# EAGLE design module-simple (EAGLE 9.6.2)

## Sheet 1 of 3
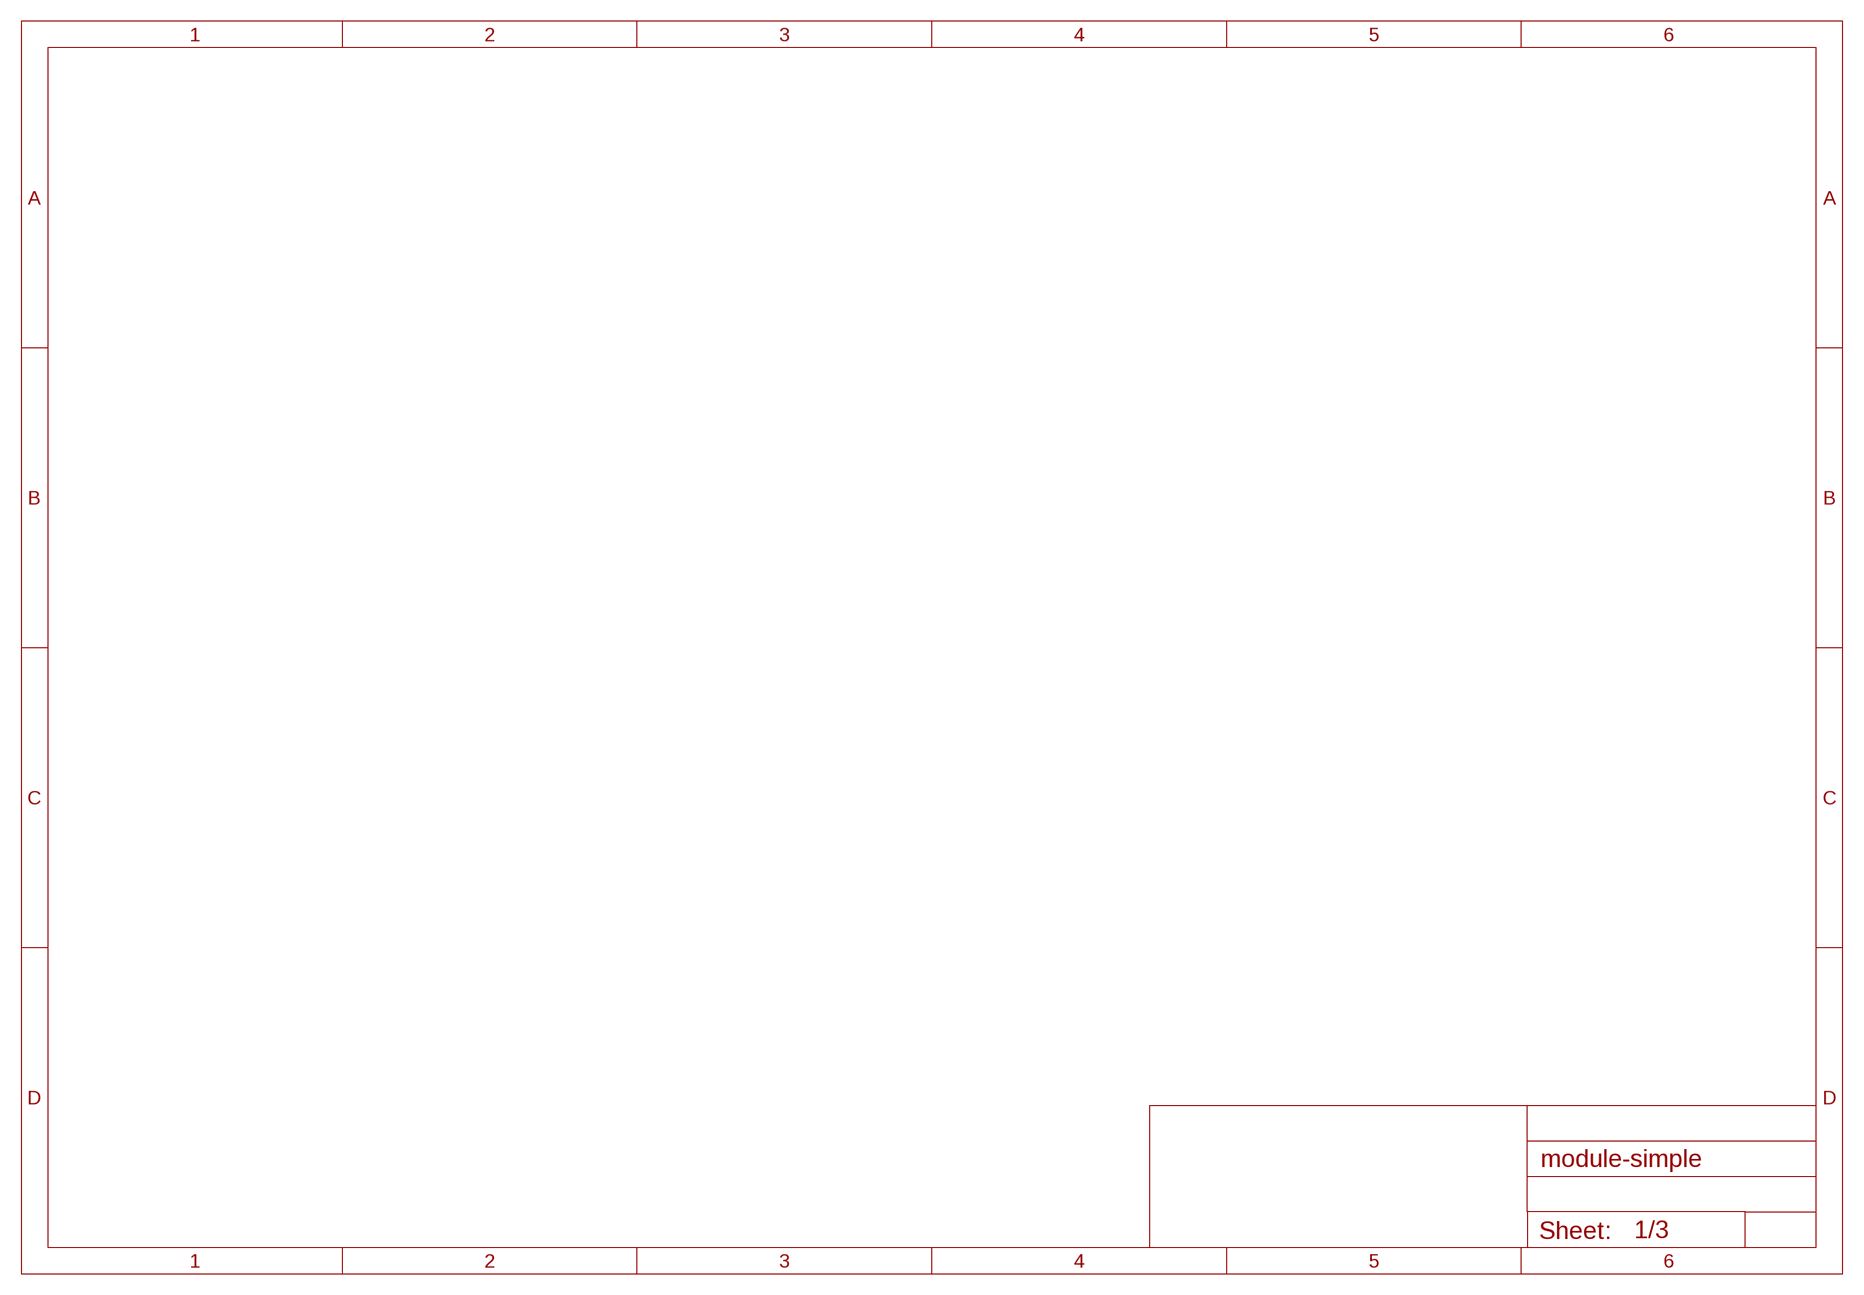
[diagram p0: schematic, sheet 1]

## Sheet 2 of 3
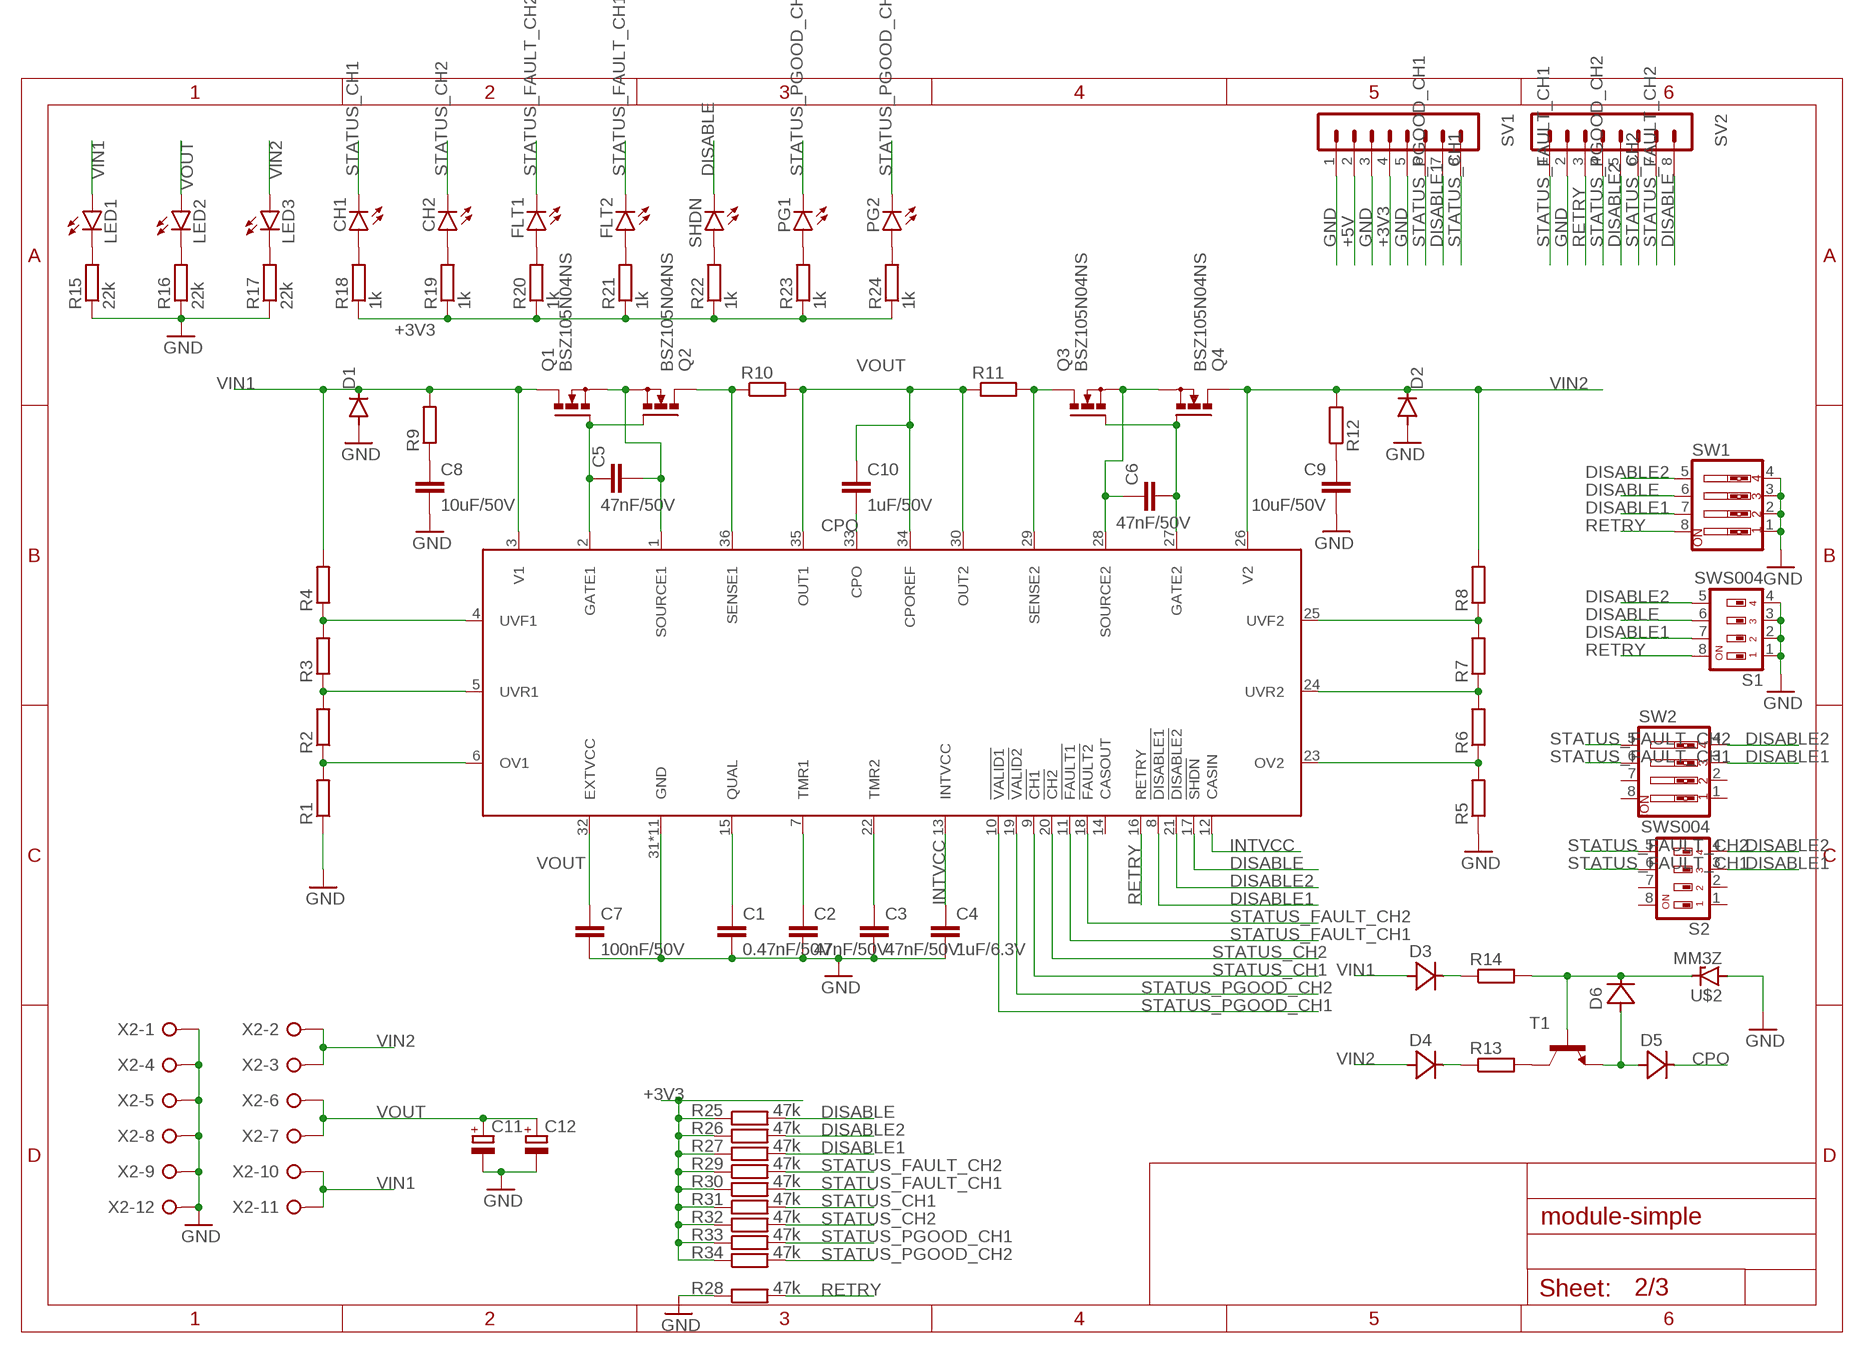
[diagram p1: schematic, sheet 2]

### Parts
C1  0.47nF/50V  C-EUC0603  [C0603]
C2  47nF/50V  C-EUC0603  [C0603]
C3  47nF/50V  C-EUC0603  [C0603]
C4  1uF/6.3V  C-EUC0603  [C0603]
C5  47nF/50V  C-EUC0603  [C0603]
C6  47nF/50V  C-EUC0603  [C0603]
C7  100nF/50V  C-EUC0603  [C0603]
C8  10uF/50V  C-EUC1206  [C1206]
C9  10uF/50V  C-EUC1206  [C1206]
C10  1uF/50V  C-EUC0805  [C0805]
C11  CPOL-EU140CLH-1010  [140CLH-1010]
C12  CPOL-EU140CLH-1010  [140CLH-1010]
CH1  LEDCHIP-LED0603  [CHIP-LED0603]
CH2  LEDCHIP-LED0603  [CHIP-LED0603]
D1  DIODE-DO214AC  [DO214AC]
D2  DIODE-DO214AC  [DO214AC]
D3  1N4148WS  [SOD323]
D4  1N4148WS  [SOD323]
D5  1N4148WS  [SOD323]
D6  1N4148WS  [SOD323]
FLT1  LEDCHIP-LED0603  [CHIP-LED0603]
FLT2  LEDCHIP-LED0603  [CHIP-LED0603]
LED1  LEDCHIP-LED0603  [CHIP-LED0603]
LED2  LEDCHIP-LED0603  [CHIP-LED0603]
LED3  LEDCHIP-LED0603  [CHIP-LED0603]
PG1  LEDCHIP-LED0603  [CHIP-LED0603]
PG2  LEDCHIP-LED0603  [CHIP-LED0603]
Q1  BSZ105N04NS  [PG-TDSON-8]
Q2  BSZ105N04NS  [PG-TDSON-8]
Q3  BSZ105N04NS  [PG-TDSON-8]
Q4  BSZ105N04NS  [PG-TDSON-8]
R1  R-EU_R0603  [R0603]
R2  R-EU_R0603  [R0603]
R3  R-EU_R0603  [R0603]
R4  R-EU_R0603  [R0603]
R5  R-EU_R0603  [R0603]
R6  R-EU_R0603  [R0603]
R7  R-EU_R0603  [R0603]
R8  R-EU_R0603  [R0603]
R9  R-EU_R0603  [R0603]
R10  R-EU_R2512  [R2512]
R11  R-EU_R2512  [R2512]
R12  R-EU_R0603  [R0603]
R13  R-EU_R0603  [R0603]
R14  R-EU_R0603  [R0603]
R15  22k  R-EU_R0603  [R0603]
R16  22k  R-EU_R0603  [R0603]
R17  22k  R-EU_R0603  [R0603]
R18  1k  R-EU_R0603  [R0603]
R19  1k  R-EU_R0603  [R0603]
R20  1k  R-EU_R0603  [R0603]
R21  1k  R-EU_R0603  [R0603]
R22  1k  R-EU_R0603  [R0603]
R23  1k  R-EU_R0603  [R0603]
R24  1k  R-EU_R0603  [R0603]
R25  47k  R-EU_R0603  [R0603]
R26  47k  R-EU_R0603  [R0603]
R27  47k  R-EU_R0603  [R0603]
R28  47k  R-EU_R0603  [R0603]
R29  47k  R-EU_R0603  [R0603]
R30  47k  R-EU_R0603  [R0603]
R31  47k  R-EU_R0603  [R0603]
R32  47k  R-EU_R0603  [R0603]
R33  47k  R-EU_R0603  [R0603]
R34  47k  R-EU_R0603  [R0603]
S1  SWS004  [SMS-004]
S2  SWS004  [SMS-004]
SHDN  LEDCHIP-LED0603  [CHIP-LED0603]
SV1  MA08-1  [MA08-1]
SV2  MA08-1  [MA08-1]
SW1  SW_DIP-4  [EDG-04]
SW2  SW_DIP-4  [EDG-04]
T1  MMBT2222ALT1-NPN-SOT23-BEC  [SOT23-BEC]
U$1  LTC4421  [QFN50P600X500X75-37T460X360N]
U$2  MM3Z  [SOD323]
X2  W237-12P  [W237-12P]

### Nets
+3V3: R18.1 R19.1 R20.1 R21.1 R22.1 R23.1 R24.1 R25.1 R26.1 R27.1 R29.1 R30.1 R31.1 R32.1 R33.1 R34.1 SV1.4 ; also sheet 3
+5V: SV1.2 ; also sheet 3
CPO: C10.2 D5.K(C) U$1.33(CPO)
DISABLE: R25.2 S1.6 SHDN.C SV2.8 SW1.6 U$1.17(!SHDN)
DISABLE1: R27.2 S1.7 S2.3 SV1.7 SW1.7 SW2.3 U$1.8(!DISABLE1)
DISABLE2: R26.2 S1.5 S2.4 SV2.5 SW1.5 SW2.4 U$1.21(!DISABLE2)
GND: C1.2 C2.2 C3.2 C4.2 C7.2 C8.2 C9.2 C11.- C12.- D1.A D2.A R1.1 R5.1 R15.1 R16.1 R17.1 R28.1 S1.1 S1.2 S1.3 S1.4 SV1.1 SV1.3 SV1.5 SV2.2 SW1.1 SW1.2 SW1.3 SW1.4 U$1.31(GND) U$1.37(GND) U$1.P$1(GND) U$1.P$2(GND) U$1.P$3(GND) U$1.P$4(GND) U$1.P$5(GND) U$1.P$6(GND) U$1.P$7(GND) U$1.P$8(GND) U$1.P$9(GND) U$2.A X2.1 X2.4 X2.5 X2.8 X2.9 X2.12 ; also sheet 3
INTVCC: C4.1 U$1.12(CASIN) U$1.13(INTVCC)
N$1: R1.2 R2.1 U$1.6(OV1)
N$2: R2.2 R3.1 U$1.5(UVR1)
N$3: R3.2 R4.1 U$1.4(UVF1)
N$4: R5.2 R6.1 U$1.23(OV2)
N$5: R6.2 R7.1 U$1.24(UVR2)
N$6: R7.2 R8.1 U$1.25(UVF2)
N$7: C5.1 Q1.4(G) Q2.4(G) U$1.2(GATE1)
N$8: C5.2 Q1.1(S) Q1.2(S) Q1.3(S) Q2.1(S) Q2.2(S) Q2.3(S) U$1.1(SOURCE1)
N$9: Q2.5(D) Q2.6(D) Q2.7(D) Q2.8(D) Q2.TH(D) R10.1 U$1.36(SENSE1)
N$10: C8.1 R9.1
N$11: C9.1 R12.1
N$12: D4.K(C) R13.1
N$13: C1.1 U$1.15(QUAL)
N$14: Q3.5(D) Q3.6(D) Q3.7(D) Q3.8(D) Q3.TH(D) R11.2 U$1.29(SENSE2)
N$15: C6.2 Q3.4(G) Q4.4(G) U$1.27(GATE2)
N$16: C6.1 Q3.1(S) Q3.2(S) Q3.3(S) Q4.1(S) Q4.2(S) Q4.3(S) U$1.28(SOURCE2)
N$17: D3.K(C) R14.1
N$18: C2.1 U$1.7(TMR1)
N$19: C3.1 U$1.22(TMR2)
N$21: R13.2 T1.C
N$22: D6.K(C) R14.2 T1.B U$2.K
N$23: D5.A D6.A T1.E
N$24: LED1.C R15.2
N$25: LED2.C R16.2
N$26: LED3.C R17.2
N$27: CH1.A R18.2
N$28: CH2.A R19.2
N$29: FLT1.A R20.2
N$30: FLT2.A R21.2
N$31: R22.2 SHDN.A
N$32: PG1.A R23.2
N$34: PG2.A R24.2
RETRY: R28.2 S1.8 SV2.3 SW1.8 U$1.16(RETRY)
STATUS_CH1: CH1.C R31.2 SV1.8 U$1.9(!CH1)
STATUS_CH2: CH2.C R32.2 SV2.6 U$1.20(!CH2)
STATUS_FAULT_CH1: FLT2.C R30.2 S2.6 SV2.1 SW2.6 U$1.11(!FAULT1)
STATUS_FAULT_CH2: FLT1.C R29.2 S2.5 SV2.7 SW2.5 U$1.18(!FAULT2)
STATUS_PGOOD_CH1: PG1.C R33.2 SV1.6 U$1.10(!VALID1)
STATUS_PGOOD_CH2: PG2.C R34.2 SV2.4 U$1.19(!VALID2)
VIN1: D1.C D3.A LED1.A Q1.5(D) Q1.6(D) Q1.7(D) Q1.8(D) Q1.TH(D) R4.2 R9.2 U$1.3(V1) X2.10 X2.11
VIN2: D2.C D4.A LED3.A Q4.5(D) Q4.6(D) Q4.7(D) Q4.8(D) Q4.TH(D) R8.2 R12.2 U$1.26(V2) X2.2 X2.3
VOUT: C7.1 C10.1 C11.+ C12.+ LED2.A R10.2 R11.1 U$1.30(OUT2) U$1.32(EXTVCC) U$1.34(CPOREF) U$1.35(OUT1) X2.6 X2.7 ; also sheet 3
Unconnected: S2.1 S2.2 S2.7 S2.8 SW2.1 SW2.2 SW2.7 SW2.8 U$1.14(CASOUT)

## Sheet 3 of 3
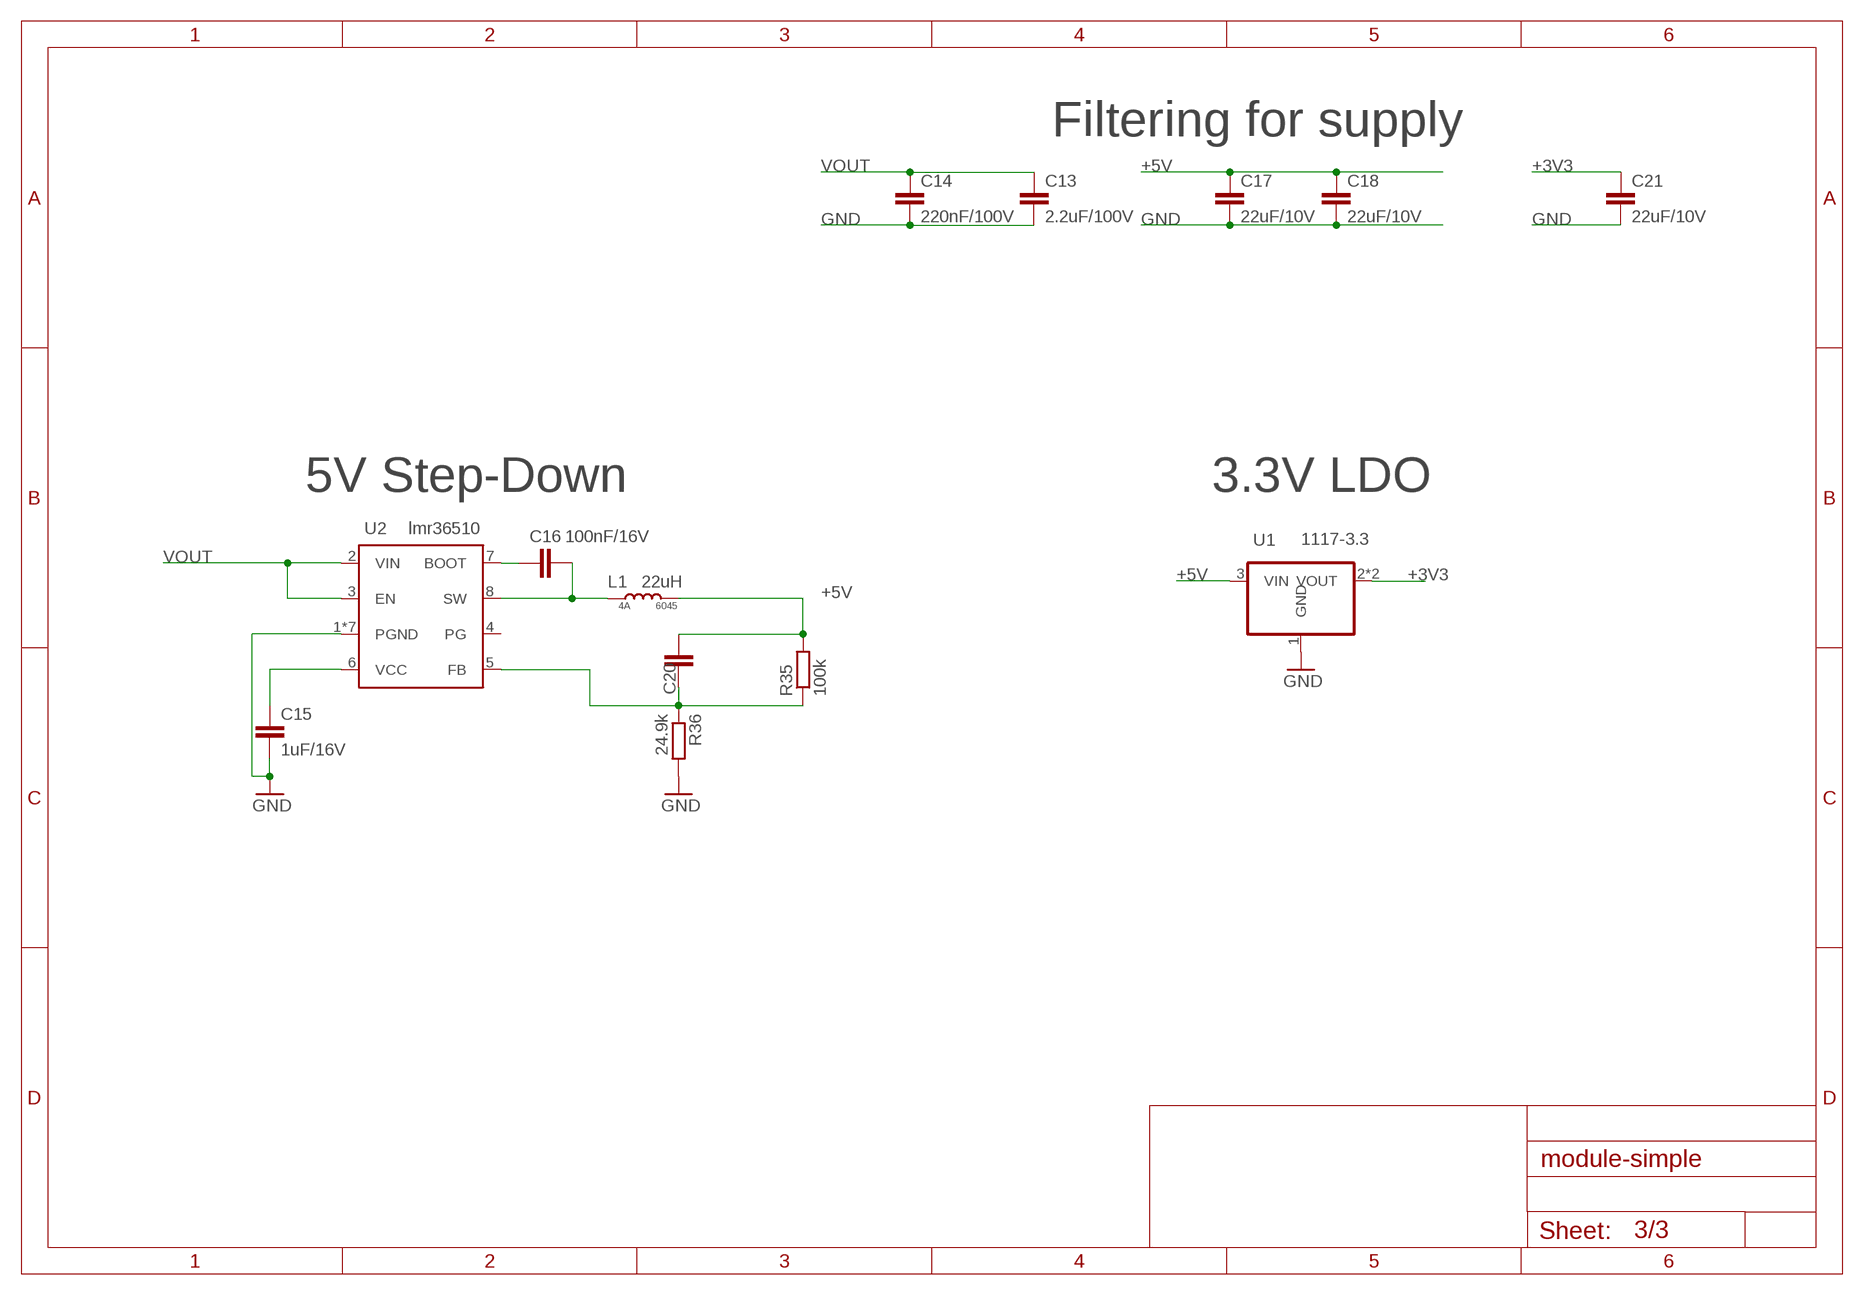
[diagram p2: schematic, sheet 3]

### Parts
C13  2.2uF/100V  C-EUC1210  [C1210]
C14  220nF/100V  C-EUC1210  [C1210]
C15  1uF/16V  C-EUC0805  [C0805]
C16  100nF/16V  C-EUC0805  [C0805]
C17  22uF/10V  C-EUC1210  [C1210]
C18  22uF/10V  C-EUC1210  [C1210]
C20  C-EUC0603  [C0603]
C21  22uF/10V  C-EUC1210  [C1210]
L1  22uH  DJNR6045  [DJNR6045]
R35  100k  R-EU_R0603  [R0603]
R36  24.9k  R-EU_R0603  [R0603]
U1  1117-3.3  LD1117S50  [SOT230P700X180-4]
U2  lmr36510  LMR36510  [SOIC127P600X170-9T240X310N]

### Nets
+3V3: C21.1 U1.2(VOUT) U1.4(VOUT) ; also sheet 2
+5V: C17.1 C18.1 C20.2 L1.P$2 R35.2 U1.3(VIN) ; also sheet 2
GND: C13.2 C14.2 C15.2 C17.2 C18.2 C21.2 R36.2 U1.1(GND) U2.1(PGND) U2.9(PGND) U2.P$1(PGND) U2.P$2(PGND) U2.P$3(PGND) U2.P$4(PGND) U2.P$5(PGND) ; also sheet 2
N$20: C15.1 U2.6(VCC)
N$33: C16.1 U2.7(BOOT)
N$35: C16.2 L1.P$1 U2.8(SW)
N$36: C20.1 R35.1 R36.1 U2.5(FB)
VOUT: C13.1 C14.1 U2.2(VIN) U2.3(EN) ; also sheet 2
Unconnected: U2.4(PG)

### Notes on the sheet
- Filtering for supply
- 5V Step-Down | 3.3V LDO

## Library data of the parts
C1-C10 C13-C18 C20 C21 = rcl:C-EU: CAPACITOR, European symbol; SPICEPREFIX: C
C11 C12 = rcl:CPOL-EU: POLARIZED CAPACITOR, European symbol; SPICEPREFIX: C
CH1 CH2 FLT1 FLT2 LED1-LED3 PG1 PG2 SHDN = led:LED: LED OSRAM: - CHIPLED LG R971, LG N971, LY N971, LG Q971, LY Q971, LO R971, LY R971 LH N974, LH R974 LS Q976, LO Q976, LY Q976 LO Q996 - Hyper CHIPLED LW Q18S LB Q993, LB Q99A, LB R99A - SideLED LS A670, LO A670, LY A670, LG A670, LP A670 LB A673, LV A673, LT A673, LW A673 LH A674 LY A675 LS A676, LA A676, LO A676, LY A676, LW A676 LS A679, LY A679, LG A679 - Hyper Micro SIDELED® LS Y876, LA Y876, LO Y876, LY Y876 LT Y87S - SmartLED LW L88C, LW L88S LB L89C, LB L89S, LG L890 LS L89K, LO L89K, LY L89K LS L896, LA L896, LO L896, LY L896 - TOPLED LS T670, LO T670, LY T670, LG T670, LP T670 LSG T670, LSP T670, LSY T670, LOP T670, LYG T670 LG T671, LOG T671, LSG T671 LB T673, LV T673, LT T673, LW T673 LH T674 LS T676, LA T676, LO T676, LY T676, LB T676, LH T676, LSB T676, LW T676 LB T67C, LV T67C, LT T67C, LS T67K, LO T67K, LY T67K, LW E67C LS E67B, LA E67B, LO E67B, LY E67B, LB E67C, LV E67C, LT E67C LW T67C LS T679, LY T679, LG T679 LS T770, LO T770, LY T770, LG T770, LP T770 LB T773, LV T773, LT T773, LW T773 LH T774 LS E675, LA E675, LY E675, LS T675 LS T776, LA T776, LO T776, LY T776, LB T776 LHGB T686 LT T68C, LB T68C - Hyper Mini TOPLED® LB M676 - Mini TOPLED Santana® LG M470 LS M47K, LO M47K, LY M47K Source: http://www.osram.convergy.de LUXEON: - LUMILED® LXK2-PW12-R00, LXK2-PW12-S00, LXK2-PW14-U00, LXK2-PW14-V00 LXK2-PM12-R00, LXK2-PM12-S00, LXK2-PM14-U00 LXK2-PE12-Q00, LXK2-PE12-R00, LXK2-PE12-S00, LXK2-PE14-T00, LXK2-PE14-U00 LXK2-PB12-K00, LXK2-PB12-L00, LXK2-PB12-M00, LXK2-PB14-N00, LXK2-PB14-P00, LXK2-PB14-Q00 LXK2-PR12-L00, LXK2-PR12-M00, LXK2-PR14-Q00, LXK2-PR14-R00 LXK2-PD12-Q00, LXK2-PD12-R00, LXK2-PD12-S00 LXK2-PH12-R00, LXK2-PH12-S00 LXK2-PL12-P00, LXK2-PL12-Q00, LXK2-PL12-R00 Source: www.luxeon.com KINGBRIGHT: KA-3528ASYC Source: www.kingbright.com
D1 D2 = diode:DIODE-: DIODE
D3-D6 = parts-diotec:1N4148WS
L1 = parts-ferrocore:DJNR6045; CURRENT: 4A; PACKAGE: 6045
Q1-Q4 = transistor-power:BSZ105N04NS: OptiMOS (TM)3 Power-Transistor N-Channel, Normal level Source : Data sheet <http://www.infineon.com/dgdl/BSZ105N04NSG_rev1.1.pdf?folderId=db3a3043156fd5730115c7d50620107c&fileId=db3a30431689f4420116c485c67f084e>
R1-R36 = rcl:R-EU_: RESISTOR, European symbol; SPICEPREFIX: R
S1 S2 = smd-special:SWS004: SMD Dip Switch 4 pol.
SV1 SV2 = con-lstb:MA08-1: PIN HEADER; OC_FARNELL: unknown; OC_NEWARK: unknown
SW1 SW2 = special:SW_DIP-4: DIP SWITCH
T1 = transistor-neu-to92:*-NPN-: NPN Transistror
U1 = parts-st:LD1117
U2 = parts-ti:LMR36510
U$1 = parts-analog_dev:LTC4421
U$2 = parts-onsemi:MM3Z
X2 = con-wago-508:W237-12P: WAGO SREW CLAMP; OC_FARNELL: unknown; OC_NEWARK: unknown

## Board
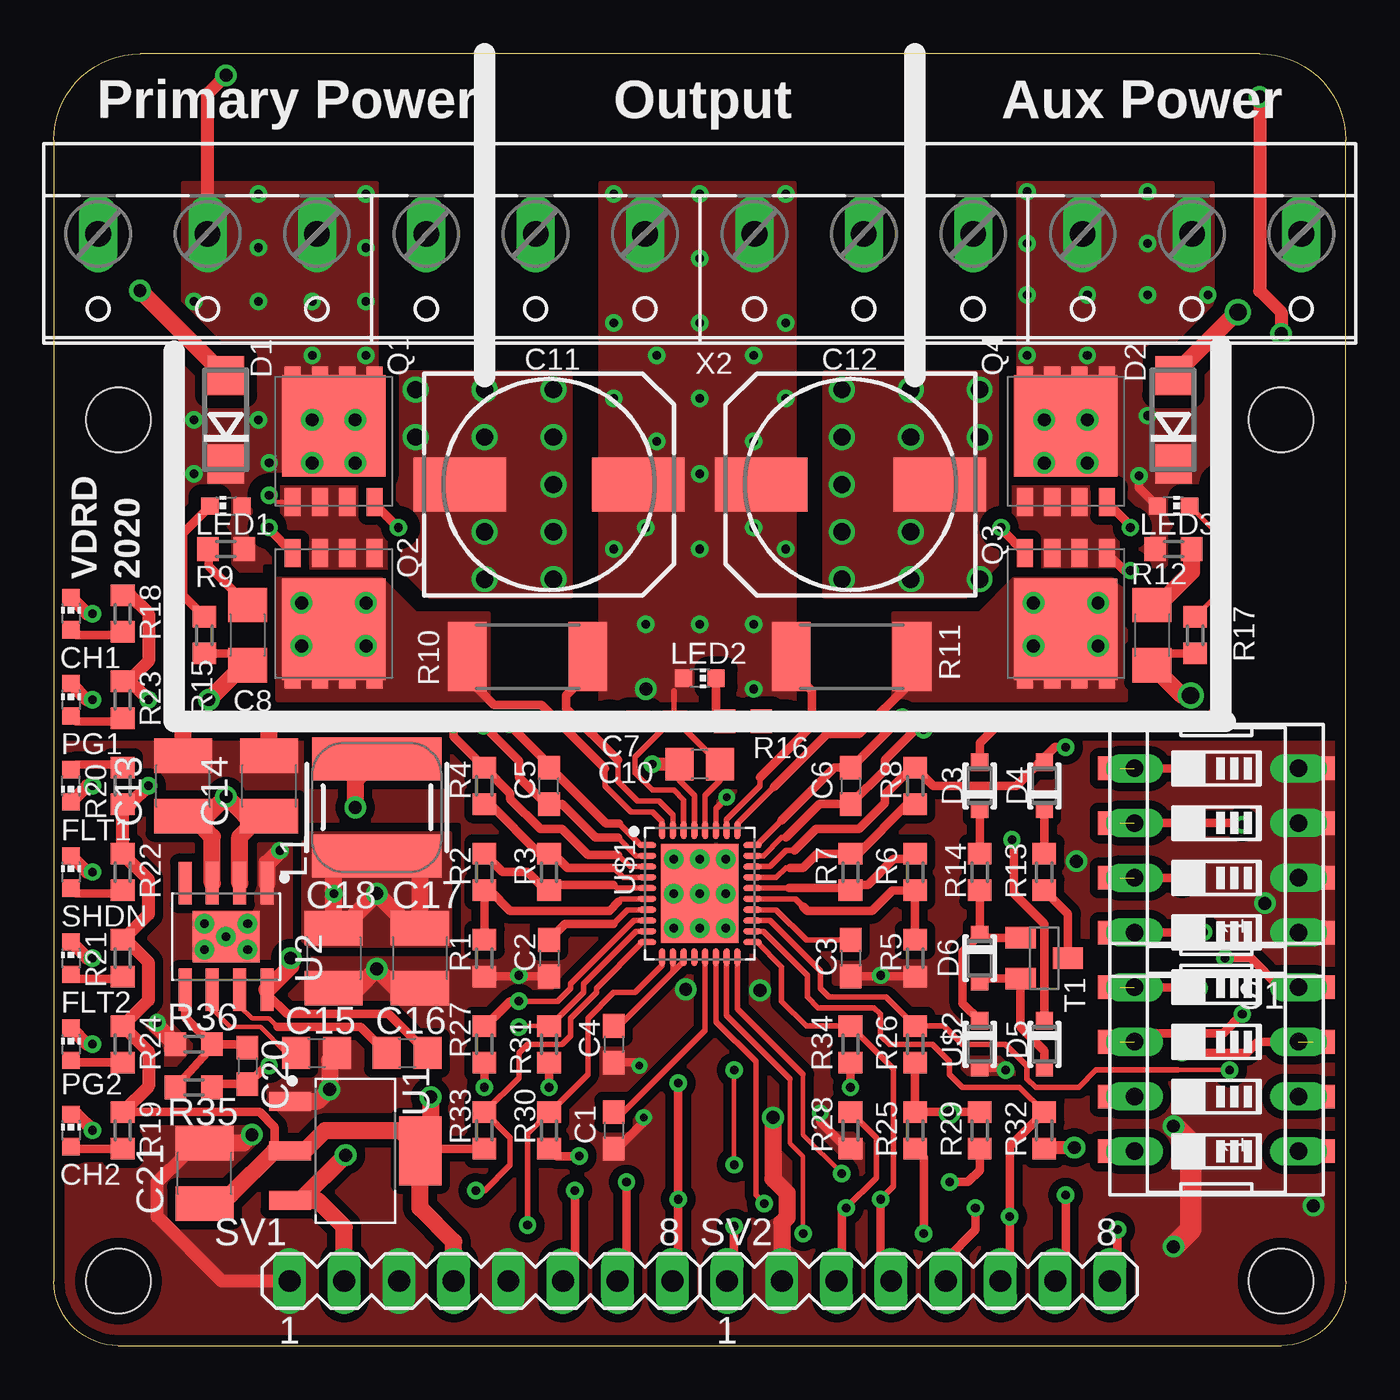
[diagram p3: board, top side]
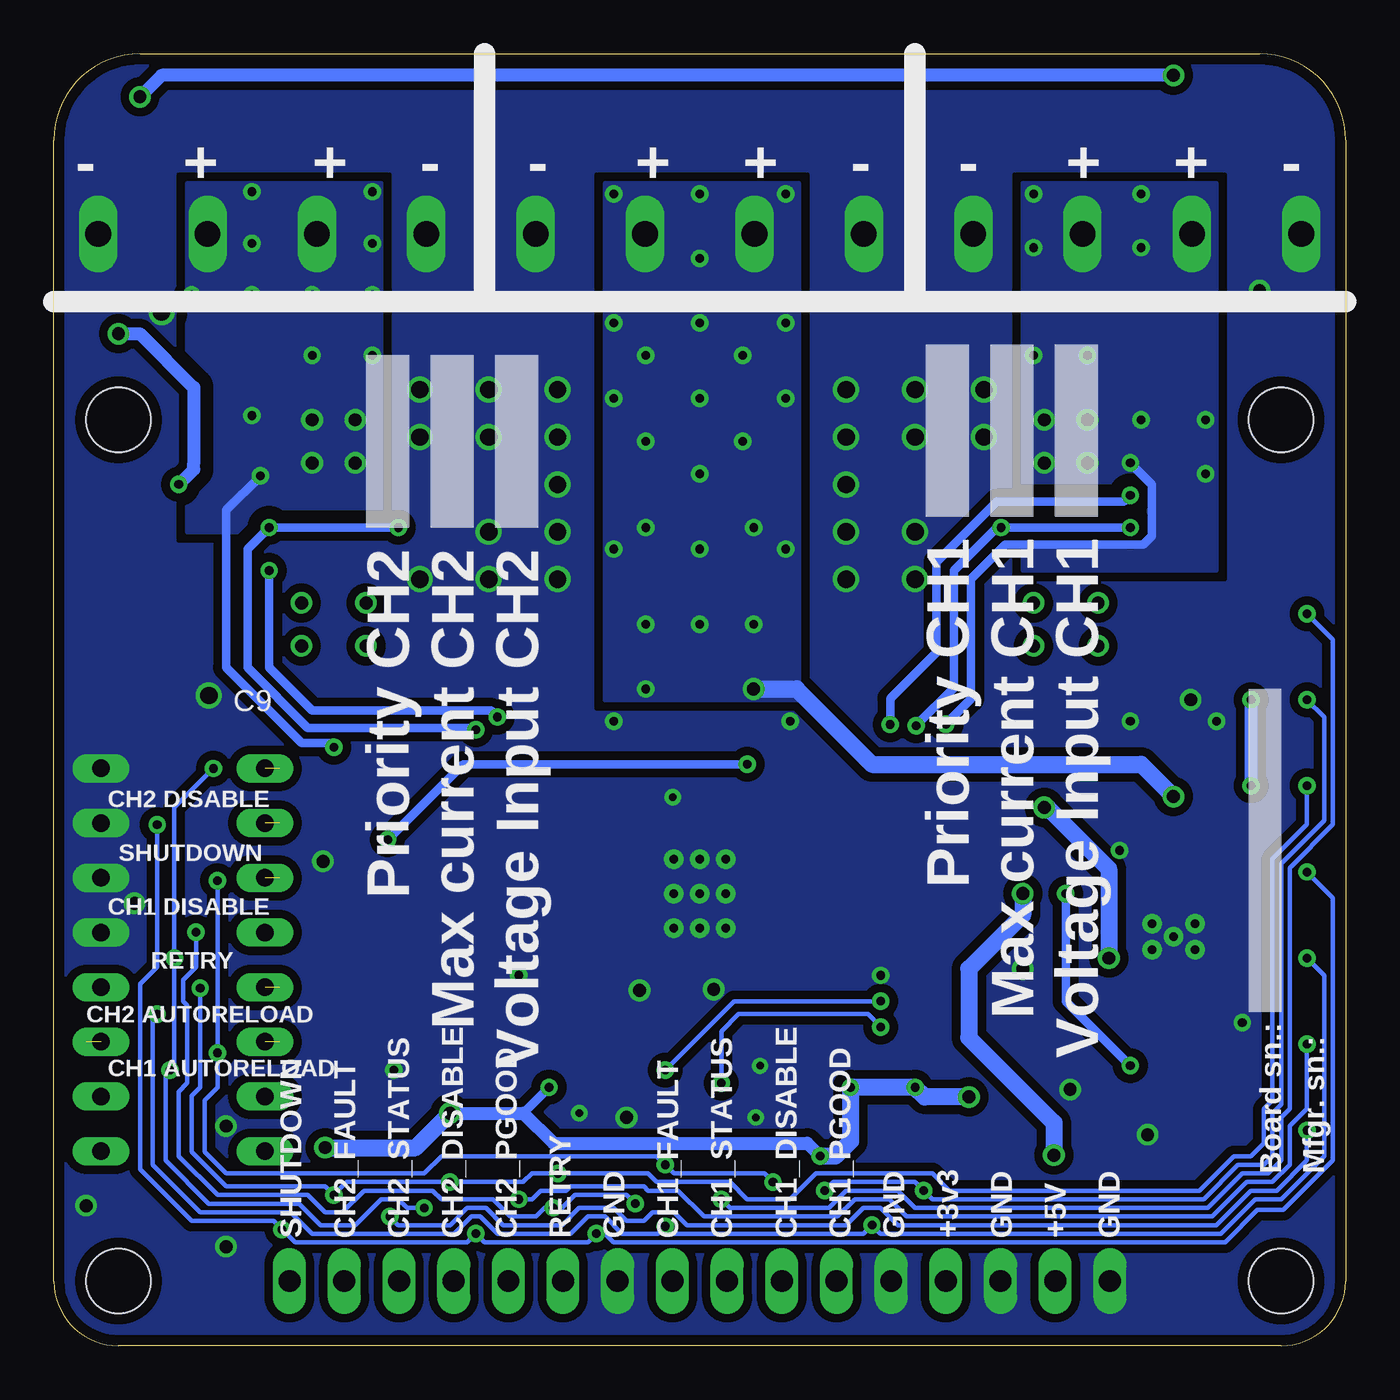
[diagram p4: board, bottom side, seen from below]

Size 60 x 60 mm. Coordinates in mm from the lower left corner, seen from the top.
Outline: 3,0 57,0 arc90 60,3 60,56 arc90 56,60 4,60 arc90 0,56 0,3 arc90 3,0
Copper layers (1*16): Top 0.035mm / dielectric 1.5mm / Bottom 0.035mm
Design rules "default *": minimum track width 6mil, minimum drill 0.2mm, track to track 6mil, track to pad 6mil, pad to pad 6mil, via to via 6mil, smd to smd 6mil, copper to edge 0.5mm, drill to drill 6mil, minimum pad ring 10mil, minimum via ring 8mil, stop-mask expansion 4mil, vias tented up to drill 0.6mm, thermal gap 10mil
Holes 3 mm at 3,43 57,43 3,3 57,3
tKeepout: area 54,40 to 60,46; area 54,0 to 60,6; area 0,0 to 6,6; area 0,40 to 6,46

### Footprints (pad centres in the part's own frame; a part is rotated, then mirrored left to right if it is on the bottom)
C0603 = smd 1.1 x 1: 1 -0.85,0; 2 0.85,0
C1206 = smd 1.6 x 1.8: 1 -1.4,0; 2 1.4,0
C0805 = smd 1.3 x 1.5: 1 -0.95,0; 2 0.95,0
140CLH-1010 = smd 4.3 x 2.5: + 4.15,0; - -4.15,0
C1210 = smd 1.6 x 2.7: 1 -1.4,0; 2 1.4,0
CHIP-LED0603 = smd 0.8 x 0.8: A 0,-0.75; C 0,0.75
DO214AC = smd 1.8 x 1.7: A 2.05,0; C -2.05,0
SOD323 = smd 0.8 x 0.8: A 1.1,0; K -1.1,0
DJNR6045 = smd 2 x 6: P$1 -2.25,0; P$2 2.25,0
PG-TDSON-8 = smd 1.3 x 0.75: 1 -2.825,1.905; 2 -2.825,0.635; 3 -2.825,-0.635; 4 -2.825,-1.905; 5 2.825,-1.905; 6 2.825,-0.635; 7 2.825,0.635; 8 2.825,1.905 | smd 4.7 x 4.8: TH 0.725,0
R0603 = smd 1 x 1.1: 1 -0.85,0; 2 0.85,0
R2512 = smd 1.8 x 3.2: 1 -2.8,0; 2 2.8,0
SMS-004 = smd 1.092 x 2.007: 1 -3.81,-4.496; 2 -1.27,-4.496; 3 1.27,-4.496; 4 3.81,-4.496; 5 3.81,4.496; 6 1.27,4.496; 7 -1.27,4.496; 8 -3.81,4.496
MA08-1 = drill 1.016 long: 1 -8.89,0; 2 -6.35,0; 3 -3.81,0; 4 -1.27,0; 5 1.27,0; 6 3.81,0; 7 6.35,0; 8 8.89,0
EDG-04 = drill 0.813 long: 1 -3.81,-3.81; 2 -1.27,-3.81; 3 1.27,-3.81; 4 3.81,-3.81; 5 3.81,3.81; 6 1.27,3.81; 7 -1.27,3.81; 8 -3.81,3.81
SOT23-BEC = smd 1 x 1.4: B -0.95,-1.1; C 0,1.1; E 0.95,-1.1
SOT230P700X180-4 = smd 1.965 x 0.889: 1 -3.023,2.3; 2 -3.023,0; 3 -3.023,-2.3 | smd 1.965 x 3.189: 4 3.023,0
SOIC127P600X170-9T240X310N = smd 1.968 x 0.602: 1 -2.473,1.905; 2 -2.473,0.635; 3 -2.473,-0.635; 4 -2.473,-1.905; 5 2.473,-1.905; 6 2.473,-0.635; 7 2.473,0.635; 8 2.473,1.905 | smd 2.4 x 3.1: 9 0,0 | drill 0.4: P$1 -0.6,1; P$2 0.6,1; P$3 -0.6,-1; P$4 0.6,-1; P$5 0,0
QFN50P600X500X75-37T460X360N = smd 0.83 x 0.27: 1 -2.45,2.25; 2 -2.45,1.75; 3 -2.45,1.25; 4 -2.45,0.75; 5 -2.45,0.25; 6 -2.45,-0.25; 7 -2.45,-0.75; 8 -2.45,-1.25; 9 -2.45,-1.75; 10 -2.45,-2.25; 19 2.45,-2.25; 20 2.45,-1.75; 21 2.45,-1.25; 22 2.45,-0.75; 23 2.45,-0.25; 24 2.45,0.25; 25 2.45,0.75; 26 2.45,1.25; 27 2.45,1.75; 28 2.45,2.25 | smd 0.27 x 0.83: 11 -1.75,-2.95; 12 -1.25,-2.95; 13 -0.75,-2.95; 14 -0.25,-2.95; 15 0.25,-2.95; 16 0.75,-2.95; 17 1.25,-2.95; 18 1.75,-2.95; 29 1.75,2.95; 30 1.25,2.95; 31 0.75,2.95; 32 0.25,2.95; 33 -0.25,2.95; 34 -0.75,2.95; 35 -1.25,2.95; 36 -1.75,2.95 | smd 3.6 x 4.6: 37 0,0 | drill 0.4: P$1 -1.2,1.6; P$2 0,1.6; P$3 1.2,1.6; P$4 1.2,0; P$5 0,0; P$6 -1.2,0; P$7 -1.2,-1.6; P$8 0,-1.6; P$9 1.2,-1.6
W237-12P = drill 1.194 long: 1 -27.94,-0.635; 2 -22.86,-0.635; 3 -17.78,-0.635; 4 -12.7,-0.635; 5 -7.62,-0.635; 6 -2.54,-0.635; 7 2.54,-0.635; 8 7.62,-0.635; 9 12.7,-0.635; 10 17.78,-0.635; 11 22.86,-0.635; 12 27.94,-0.635

### Placement (x,y rotation side)
C1  26,10 270 top
C2  23,18 270 top
C3  37,18 270 top
C4  26,14 270 top
C5  23,26 90 top
C6  37,26 270 top
C7  28,29 180 top
C8  9,33 270 top
C9  51,33 270 top
C10  30,27 180 top
C11  23,40 0 top
C12  37,40 180 top
C13  6,26 90 top
C14  10,26 90 top
C15  12.2,13.6 0 top
C16  16.4,13.6 0 top
C17  17,18 270 top
C18  13,18 270 top
C20  9,13 270 top
C21  7,8 90 top
CH1  0.8,34 0 top
CH2  0.8,10 0 top
D1  8,43 90 top
D2  52,43 90 top
D3  43,26 90 top
D4  46,26 90 top
D5  46,14 270 top
D6  43,18 270 top
FLT1  0.8,26 180 top
FLT2  0.8,18 0 top
L1  15,25 270 top
LED1  8,39 90 top
LED2  30,31 270 top
LED3  52,39 270 top
PG1  0.8,30 0 top
PG2  0.8,14 0 top
Q1  13,42 90 top
Q2  13,34 270 top
Q3  47,34 270 top
Q4  47,42 90 top
R1  20,18 90 top
R2  20,22 90 top
R3  23,22 90 top
R4  20,26 90 top
R5  40,18 90 top
R6  40,22 90 top
R7  37,22 90 top
R8  40,26 90 top
R9  8,37 0 top
R10  22,32 0 top
R11  37.05,32 0 top
R12  52,37 180 top
R13  46,22 270 top
R14  43,22 270 top
R15  7,33 90 top
R16  32,29 180 top
R17  53,33 90 top
R18  3.2,34 270 top
R19  3.2,10 270 top
R20  3.2,26 90 top
R21  3.2,18 270 top
R22  3.2,22 270 top
R23  3.2,30 270 top
R24  3.2,14 270 top
R25  40,10 270 top
R26  40,14 90 top
R27  20,14 90 top
R28  37,10 90 top
R29  43,10 270 top
R30  23,10 90 top
R31  23,14 90 top
R32  46,10 90 top
R33  20,10 90 top
R34  37,14 90 top
R35  6.5,12 0 top
R36  6.5,14 180 top
S1  54,23 90 top
S2  54,12.84 90 top
SHDN  0.8,22 0 top
SV1  19.84,3 0 top
SV2  40.16,3 0 top
SW1  54,23 90 top
SW2  54,12.84 90 top
T1  46,18 270 top
U1  14,9.05 0 top
U2  8,19 270 top
U$1  30,21 0 top
U$2  43,14 270 top
X2  30,51 180 top

### Tracks (layer width: path | path; a pad name or v marks a point on that pad's centre or on a via)
+3V3  (via drill 0.4, 0.6)
  Top 0.4: R19.1 9.55,10.85 10.25,10.15 10.25,9.05 | R26.1 R25.1 41.55,10.85 v41.6,10.8 41.65,10.85 R29.1 | R27.1 v20,12 | v24.4,8.8 23.35,8.8 R30.1 | R31.1 v23,12 | R34.1 v37,12 | R33.1 17.12,9.15 17,9.03
  Top 0.6: 3.55,10.85 R19.1 4.4,12.05 4.4,13.65 R24.1 4.4,16.05 4.4,17.8 3.35,18.85 R21.1 4.4,20.05 4.4,21.65 R22.1 R20.1 3.55,25.15 v4.4,26 | R18.1 3.55,34.85 4.4,34 4.4,31.8 3.45,30.85 R23.1 3.55,30.85 v4.4,30 | 19.9,9.05 R33.1 | v47.4,9.2 46.05,9.2 R32.1
  Top 0.8: U1.4 16.07,10 12.6,10 11.65,9.05 U1.2 10.25,9.05 8.2,7 7.4,7 C21.1 6.2,6.6 | SV1.4 18.57,4.83 17,6.4 17,9.03 U1.4 | U1.4 17.5,9.53 v17.5,11.55
  Bottom 0.4: v37,12 38.2,10.8
  Bottom 0.6: v4.4,30 v4.4,26 | v24.4,8.8 25,9.4 36.8,9.4 38.2,10.8 v41.6,10.8
  Bottom 0.8: v47.4,9.2 43.2,9.2 v41.6,10.8 | v17.5,11.55 19.55,11.55 v20,12 v23,12 23,9.5 23.7,8.8 v24.4,8.8
+5V  (via drill 0.4, 0.6)
  Top 0.4: v10,13 9.85,13 C20.2 7.5,12.15 R35.2
  Top 0.8: 13,22.5 v13,21 C18.1 13.4,19.4 v15,21 16.6,19.4 C17.1 17,22 | U1.3 11.45,6.75 | 11.45,6.75 12.25,6.75 13.49,5.51 SV1.2 | 11.45,6.75 v13.55,8.85
  Bottom 0.4: v10,13 13,16 v13,21
  Bottom 0.8: v15,21 15,20 17.5,17.5 17.5,14.3 13.55,10.35 v13.55,8.85
  pour Top (isolate 0.4, no thermals): 11.6,23.8 11.6,18.6 18.4,18.6 18.4,23.8
CPO  (via drill 0.4)
  Top 0.2: 29.05,26.25 C10.2
  Top 0.25: U$1.33 29.75,25.55 29.05,26.25
  Top 0.4: v44.5,23.5 44.6,23.4 44.6,21 46,19.6 D5.K
  Top 0.6: C10.2 v27.8,27
  Bottom 0.4: v44.5,23.5 41,27 v27.8,27
DISABLE  (via drill 0.4)  (1 unrouted)
  Top 0.2: 34.2,12.4 34.2,9.4 34.8,8.8 v34.8,5.2
  Top 0.25: U$1.17 31.25,15.35 34.2,12.4
  Top 0.4: v49.4,5.4 49.4,3.35 SV2.8 | R25.2 40.4,8.75 v40.4,5.2 | S1.6 55.13,24.27 v55.2,24.2
  Top 0.6: SHDN.C 1.55,22 v1.8,22
  Bottom 0.2: v1.8,22 0.6,20.8 0.6,8.6 2.9,6.3 4.1,6.3 5.6,4.8 34,4.8 34.4,5.2 v34.8,5.2 35.2,4.8 40,4.8 v40.4,5.2 40.8,4.8 48.8,4.8 v49.4,5.4 49.8,5.8 53.6,5.8 56,8.2 56,16.8 55.2,17.6 v55.2,24.2
DISABLE1  (via drill 0.4)  (2 unrouted)
  Top 0.2: v31.6,12.8 v31.6,8.4
  Top 0.25: U$1.8 26.95,19.75 24,16.8 24,16.6 23.4,16 21.15,16 R27.2
  Top 0.4: SV1.7 26.6,3.41 v26.6,7.6 | R27.2 20.05,14.85 21.2,16 v21.6,16 | v52.4,13.6 55.4,13.6 55.91,14.11 S2.3 | S1.7 52.27,21.73 v52.4,21.6
  Bottom 0.2: v26.6,7.6 27,8 31.2,8 v31.6,8.4 32,8.8 42,8.8 42.8,8 52,8 53,9 53,11.4 52.4,12 v52.4,13.6 v52.4,21.6 | v21.6,16 28.4,16 v31.6,12.8
DISABLE2  (via drill 0.4)  (1 unrouted)
  Top 0.2: 52.2,12.8 v54.6,12.8 | S2.4 56.85,16.65
  Top 0.25: U$1.21 33.25,19.75 35.6,17.4 35.6,16.6 36,16.2 38.65,16.2 R26.2 41.35,14.85 42.2,14 44.2,14 45.2,13 45.2,12.4 45.6,12 47.6,12 48.4,12.8 52.2,12.8
  Top 0.4: S1.5 v52.59,26.81 | S2.4 SW2.4 | S2.4 57.25,16.65 | SV2.5 41.43,4 42.8,5.37 v42.8,6.4 | S2.4 56.95,16.65 55.6,18 v54.4,18
  Bottom 0.2: v42.8,6.4 43.6,6.4 44,6.8 44.8,6.8 46,5.6 47.6,5.6 48.6,6.6 52.8,6.6 54.8,8.6 54.8,12.6 v54.6,12.8 54.4,13 v54.4,18 | v54.4,18 54.4,18.4 | v54.4,18 54.4,25 v52.59,26.81
GND  (via drill 0.35, 0.4, 0.6, 0.8)
  Top 0.2: v31.25,25.47 31.25,25.45
  Top 0.25: U$1.31 30.75,24.95 31.25,25.45
  Top 0.4: R17.1 51.55,32.15 C9.2 | R15.1 8.45,32.15 C8.2 | C2.2 21.65,17.15 v21.6,17.2 21.55,17.15 R1.1 | C3.2 38.35,17.15 v38.4,17.2 38.45,17.15 R5.1 | U$2.A 44.1,12.9 v44.2,12.8 | C7.2 v25.8,29 | R16.1 v34,29 | C4.2 27.05,13.15 v27.2,13 | v27.4,10.6 27.4,10.4 26.15,9.15 C1.2 | R28.1 36.85,9.15 35.6,10.4 v35.6,10.8 | S1.4 SW1.4 | C21.2 6.6,9.4 6,8.8
  Top 0.6: SV1.1 7.8,3 4.8,6 4.8,7.6 6,8.8
  Top 0.8: D2.A 54.95,48 v55,48 | v52.8,30.2 52.4,30.2 C9.2 | D1.A 7.95,45.05 v4,49 | C8.2 8.8,31.6 v7.2,30 | C14.2 v10,29 | C13.2 v6,29 | U2.1 9.9,22.41 v10.5,23 | R36.2 4.8,14.85 v4.8,15 | C18.2 14.1,16.6 v15,17.5 15.9,16.6 C17.2 | U1.1 12.25,11.35 v12.8,11.9 12.8,13.25 C15.2 | v9.2,9.8 8.8,9.4 C21.2 | v33.4,10.6 33.4,7.75 34.06,7.1 34.06,5.95 33.81,5.71 SV2.2
  Top 1: v52,10.2 52.8,9.4 52.8,5.4 v52,4.6
  Bottom 0.2: v31.25,25.47 31.25,25.5
  other vias: 16.8,44.4 20,44.4 23.2,44.4 16.8,42.2 20,42.2 23.2,42.2 23.2,40 23.2,37.8 23.2,35.6 20,35.6 20,37.8 43,35.6 39.8,35.6 36.6,35.6 39.8,37.8 36.6,37.8 36.6,40 36.6,42.2 36.6,44.4 39.8,44.4 43,44.4 43,42.2 39.8,42.2 32.8,16.5 56.25,20.55 47.5,22.5 58.5,6.5 29.35,16.55
  pour Bottom (isolate 0.4, rank 6, no thermals): -1,-1 61,-1 61,61 -1,61
  pour Top (isolate 0.6, rank 6, no thermals): 16,45.2 24,45.2 24,34.8 16,34.8
  pour Top (isolate 0.6, rank 6, no thermals): 43.8,34.8 35.8,34.8 35.8,45.2 43.8,45.2
  pour Top (isolate 0.4, rank 6, no thermals): -2,-2 5,-2 62,-2 62,28 -2,28
INTVCC
  Top 0.25: U$1.12 28.75,17.35 | C4.1 26.25,14.85 28.75,17.35 | U$1.13 29.25,17.85 28.75,17.35
N$1
  Top 0.25: U$1.6 26.35,20.75 26.2,20.6
  Top 0.4: 26.2,20.6 25.8,20.2 21.2,20.2 20.25,21.15 R2.1 R1.2
N$2
  Top 0.25: U$1.5 26.15,21.25 26,21.4
  Top 0.4: 26,21.4 23.25,21.4 R3.1 22.85,21.15 22,22 20.85,22 R2.2
N$3
  Top 0.25: U$1.4 26.45,21.75 26,22.2
  Top 0.4: 26,22.2 23.85,22.2 23.2,22.85 R3.2 22.55,22.85 20.25,25.15 R4.1
N$4
  Top 0.25: U$1.23 34.45,20.75 34.8,20.4
  Top 0.4: R5.2 R6.1 38.95,21.15 38,20.2 35,20.2 34.8,20.4
N$5
  Top 0.25: U$1.24 34.15,21.25
  Top 0.4: R6.2 40,22.8 39.8,22.6 39,22.6 37.8,21.4 37.25,21.4 R7.1 36.9,21.25 34.15,21.25
N$6
  Top 0.25: U$1.25 33.55,21.75 34,22.2 34.2,22.2
  Top 0.4: R8.1 39.65,25.15 37.35,22.85 R7.2 35.45,22.85 34.8,22.2 34.2,22.2
N$7  (via drill 0.4)
  Top 0.25: U$1.2 27.05,22.75 26.2,23.6
  Top 0.4: Q2.4 10,37.92 v10,38 | v16,38 14.9,39.09 Q1.4 | 26.2,23.6 25.15,23.6 23.6,25.15 C5.1 22.85,25.15 21.6,26.4 21.6,27.15 v19.95,28.8
  Bottom 0.4: v10,38 v16,38 16.2,38 18.2,36 18.2,30.55 v19.95,28.8
N$8  (via drill 0.4)
  Top 0.152: U$1.1 27.25,23.25
  Top 0.2: Q1.1 10.32,39.17 v10,39.5
  Top 0.25: 27.25,23.25 26.25,24.25
  Top 0.4: 26.25,24.25 25.65,24.25 23.05,26.85 C5.2 23,27 v21.15,28.85
  Bottom 0.4: v10,39.5 10.3,39.2 16.2,39.2 19,36.4 19,32.2 21.15,30.05 v21.15,28.85
  pour Top (isolate 0.4, rank 2, no thermals): 10.6,40 15.4,40 15.4,36 10.6,36
N$9  (via drill 0.6)
  Top 0.25: U$1.36 28.25,24.35 27.8,24.8 26.8,24.8 25.6,26 25.6,26.8
  Top 0.4: R10.1 19.2,31 20.45,29.75 22.65,29.75 25.6,26.8
  other vias: 11.5,34.5 14.5,34.5 14.5,32.5 11.5,32.5
  pour Top (rank 2, no thermals): 10.4,35.6 15.2,35.6 16.8,34 20.2,34 20.2,30 10.4,30
N$10
  Top 0.4: C8.1 7.2,36.2 7.2,37.2 7.15,37.15 R9.1
N$11
  Top 0.8: C9.1 51.3,34.4 52.85,35.95 R12.1
N$12
  Top 0.4: R13.1 D4.K
N$13
  Top 0.25: U$1.15 30.25,14.65 26.45,10.85 C1.1
N$14  (via drill 0.6)
  Top 0.25: U$1.29 31.75,24.25 33.45,25.95
  Top 0.4: R11.2 39.85,30.85 37.4,28.4 35.9,28.4 33.45,25.95
  other vias: 45.5,34.5 48.5,34.5 48.5,32.5 45.5,32.5
  pour Top (isolate 0.4, no thermals): 39,34 43,34 44.6,35.6 49.8,35.6 49.8,30 39,30
N$15  (via drill 0.4)
  Top 0.25: U$1.27 32.95,22.75 33.8,23.6 34,23.6
  Top 0.4: Q4.4 50,38.08 v50,38 | v44,38 44,37.92 Q3.4 | 34,23.6 35.55,25.15 C6.2 38.6,26.75 38.6,27.2 40,28.6 v40.4,28.6
  Bottom 0.4: v44,38 v50,38 51,37 51,31.5 48.2,28.7 40.5,28.7 v40.4,28.6
N$16  (via drill 0.4)
  Top 0.25: U$1.28 32.65,23.25 33.8,24.4
  Top 0.4: Q3.1 49.73,36 v50,36 | 33.8,24.4 36.25,26.85 C6.1 37.05,26.85 v39.4,29.2
  Bottom 0.4: v50,36 50,31.5 48,29.5 39.7,29.5 v39.4,29.2
  pour Top (isolate 0.4, rank 2, no thermals): 44.6,40 49.4,40 49.4,36 44.6,36
N$17
  Top 0.4: R14.1 D3.K
N$18
  Top 0.25: U$1.7 26.65,20.25 26,19.6
  Top 0.4: 26,19.6 23.75,19.6 C2.1
N$19
  Top 0.25: U$1.22 33.55,20.25 34.95,18.85 C3.1
N$20
  Top 0.2: 10.8,13.6 9.6,14.8 8.2,14.8 7.37,15.63
  Top 0.4: C15.1 10.8,13.6 | U2.6 7.37,15.63
N$21
  Top 0.4: T1.C 47.1,20.05 R13.2
N$22
  Top 0.4: T1.B 43.15,18.95 D6.K | U$2.K 42.2,15.9 42.2,18.3 D6.K | D6.K R14.2
N$23
  Top 0.4: D6.A 43.15,17.05 T1.E 44.9,14.8 46,13.7 D5.A
N$24
  Top 0.4: R15.2 6,34.85 6,37.75 LED1.C
N$25
  Top 0.4: LED2.C 30.75,29.4 R16.2
N$26
  Top 0.2: LED3.C 53.8,37.95 53.8,34.65 R17.2
N$27
  Top 0.4: CH1.A 1.05,33 3.05,33 R18.2
N$28
  Top 0.4: CH2.A 0.9,9.15 R19.2
N$29
  Top 0.4: FLT1.A 1.05,27 3.05,27 R20.2
N$30
  Top 0.4: FLT2.A 1.01,17.04 3.09,17.04 R21.2
N$31
  Top 0.4: SHDN.A 1.05,21 3.05,21 R22.2
N$32
  Top 0.4: PG1.A 1.05,29 3.05,29 R23.2
N$33
  Top 0.2: U2.7 8.63,15.77 9.2,15.2 10,15.2 10.4,14.8
  Top 0.4: C16.1 14.25,14.8 10.4,14.8
N$34
  Top 0.4: PG2.A 0.9,13.15 R24.2
N$35  (via drill 0.6)
  Top 0.4: C16.2 15.55,15.4 10.83,15.4 9.9,16.33 U2.8
  Top 0.8: L1.P$1 14,26.25 v14,25 | U2.8 11,17.62 v11,18
  Bottom 0.8: v14,25 13.85,25 11,22.15 v11,18
N$36
  Top 0.4: U2.5 6.09,15.26 R36.1 | R36.1 7.35,13.89 R35.1 | C20.1 8.85,14 R36.1
RETRY  (via drill 0.4)
  Top 0.25: U$1.16 30.75,15.05 32.6,13.2 32.6,7 v33,6.6 | R28.2 38.2,9.65 38.2,7.8 v36.8,6.4
  Top 0.4: SV2.3 36.6,3.25 36.6,6.2 v36.8,6.4 | v53.4,19.2 SW1.8 | SW1.8 | S1.8 49.51,19.2 SW1.8
  Bottom 0.2: v33,6.6 33.4,7 35.8,7 36.4,6.4 v36.8,6.4 37.2,6.4 37.6,6 38.8,6 39.6,6.8 42,6.8 42.4,7.2 45.6,7.2 46.6,6.2 47.4,6.2 48.2,7 52.4,7 54.2,8.8 54.2,11.8 53.8,12.2 53.8,15.8 54,16 54,17 53.4,17.6 v53.4,19.2
STATUS_CH1  (via drill 0.4)
  Top 0.2: R31.2 21.65,14.85 v21.6,14.8
  Top 0.25: U$1.9 27.05,19.25 24.6,16.8 24.6,16.4 23.05,14.85 R31.2
  Top 0.4: SV1.8 29,3.27 v29,6.8 v29,12.2
  Top 0.6: CH1.C 1.55,34 v1.8,34
  Bottom 0.2: v1.8,34 0.6,32.8 0.6,24.2 2.6,22.2 2.6,11 3,10.6 3,8.6 3.6,8 4.8,8 6.4,6.4 20,6.4 20.8,7.2 23.2,7.2 24,6.4 28.6,6.4 v29,6.8 | v21.6,14.8 22.2,15.4 28.2,15.4 29,14.6 v29,12.2
STATUS_CH2  (via drill 0.4)
  Top 0.25: U$1.20 32.95,19.25 35,17.2 35,16.2 35.5,15.7 38.1,15.7 38.4,15.4 38.4,14.4 38.8,14 40.8,14 41.6,13.2 41.6,12.6 42.2,12 44.85,12 R32.2
  Top 0.4: SV2.6 44.4,3.43 v44.4,6 44.4,9.25 R32.2
  Top 0.6: CH2.C 1.05,10.75 v1.8,10
  Bottom 0.2: v1.8,10 1.8,8.6 3.2,7.2 4.4,7.2 6,5.6 20.8,5.6 21.6,6.4 22.4,6.4 23.2,5.6 30.6,5.6 31.2,6.2 32.2,6.2 32.6,5.8 33.4,5.8 34,6.4 35.6,6.4 36.4,5.6 39.13,5.6 39.93,6.4 40.8,6.4 41.6,5.6 44,5.6 v44.4,6
STATUS_FAULT_CH1  (via drill 0.4)  (1 unrouted)
  Top 0.25: U$1.11 28.25,17.65 27,16.4 26,16.4 24.8,15.2 24.8,12.6 23,10.8 R30.2 22,9.85 v22,5.6
  Top 0.4: v31.6,5.54 31.6,3.33 SV2.1 | S2.6 49.9,14.51 54.31,14.51 v55.2,15.4
  Top 0.6: FLT2.C 1.55,18 v1.8,18
  Bottom 0.2: v1.8,18 1,17.2 1,8.8 3,6.8 4.2,6.8 5.8,5.2 21.6,5.2 v22,5.6 22.4,5.2 31.26,5.2 v31.6,5.54 31.94,5.2 33.6,5.2 34.4,6 35.2,6 36,5.2 39.4,5.2 40.2,6 40.6,6 41.4,5.2 48,5.2 49,6.2 53.2,6.2 55.4,8.4 55.4,15.2 v55.2,15.4
STATUS_FAULT_CH2  (via drill 0.4)  (1 unrouted)
  Top 0.2: 34.8,12.6 34.8,9.8 v36.6,8
  Top 0.25: U$1.18 31.75,15.65 34.8,12.6
  Top 0.4: SV2.7 47,3.49 v47,7 | R29.2 43,8.15 42.45,7.6 v41.6,7.6 | v53.2,16.6 53.15,16.65 S2.5
  Top 0.6: FLT1.C 1.55,26 v1.8,26
  Bottom 0.2: v1.8,26 1.8,24.2 3.4,22.6 3.4,11.4 3.8,11 3.8,9.4 4.4,8.8 5.2,8.8 6.8,7.2 18.4,7.2 19.2,8 24.6,8 25.8,6.8 27.8,6.8 28.6,7.6 32,7.6 32.4,8 v36.6,8 37.8,8 38.2,7.6 v41.6,7.6 46.4,7.6 v47,7 47.4,7.4 52,7.4 53.6,9 53.6,11.6 53.2,12 v53.2,16.6
STATUS_PGOOD_CH1  (via drill 0.4)
  Top 0.25: U$1.10 27.35,18.75 25.2,16.6 25.2,16.4 24,15.2 24,14.4 23.6,14 22,14 21.6,13.6 21.6,12.45 R33.2 21.2,9.65 21.2,8.4 20,7.2 v19.6,7.2
  Top 0.4: SV1.6 24.2,3.55 v24.2,7.2
  Top 0.6: PG1.C 1.55,30 v1.8,30
  Bottom 0.2: v1.8,30 1,29.2 1,24.4 3,22.4 3,11.2 3.4,10.8 3.4,8.8 3.8,8.4 5,8.4 6.6,6.8 19.2,6.8 v19.6,7.2 20,7.6 23.8,7.6 v24.2,7.2
STATUS_PGOOD_CH2  (via drill 0.4)
  Top 0.25: U$1.19 32.65,18.75 33.8,17.6 33.8,16 34.95,14.85 R34.2 39,12.85 39,7.4 v38.4,6.8
  Top 0.4: SV2.4 38.4,3.49 v38.4,6.8
  Top 0.6: PG2.C 1.55,14 v1.8,14
  Bottom 0.2: v1.8,14 1.8,11 2.6,10.2 2.6,8.4 3.4,7.6 4.6,7.6 6.2,6 20.4,6 21.2,6.8 22.8,6.8 23.6,6 29.8,6 31,7.2 32.4,7.2 32.6,7.4 36,7.4 36.2,7.2 37.4,7.2 37.8,6.8 v38.4,6.8
VIN1  (via drill 0.4, 0.6)
  Top 0.25: U$1.3 26.75,22.25 26.2,22.8
  Top 0.4: 26.2,22.8 24.8,22.8 23.6,24 22.6,24 21.2,25.4 21.2,25.65 R4.2 18.57,28.28 v18.57,28.87 | v54.2,40 54.4,39.8 54.4,30 53.4,29 44,29 43,28 D3.A
  Top 0.6: X2.11 7.14,58.14 v8,59 | v57,47 57,48 56,49 v56,58
  Bottom 0.4: v10,41 9,40 9,37.6 9.4,37.2 15.8,37.2 17.4,35.6 17.4,30.03 v18.57,28.87
  Bottom 0.6: v8,59 55,59 v56,58 | v57,47 56,47 53.5,44.5 53.5,41 53.5,40.7 v54.2,40
  other vias: 14,41 12,41 12,43 14,43 14.5,53.5 14.5,51 14.5,48.5 14.5,46 12,46 12,48.5 9.5,48.5 6.5,48.5 9.5,51 9.5,53.5 9.5,43 6.5,43 6.5,40.5
  pour Top (isolate 0.6, rank 3, no thermals): 6,54 15,54 15,36 6,36
  pour Bottom (isolate 0.6, rank 5, no thermals): 6,54 15,54 15,36 6,36
VIN2  (via drill 0.4, 0.6)
  Top 0.25: U$1.26 33.25,22.25 34,23 34.4,23
  Top 0.4: LED3.A 50.4,39.85 v50.4,40.4 | 34.4,23 35.4,24 37.4,24 38.6,25.2 38.6,25.6 39.85,26.85 R8.2 40.85,26 44.7,26 45.8,27.1 | 45.8,27.1 D4.A | v47,27.8 46.5,27.8 45.8,27.1
  Bottom 0.4: v50.4,40.4 52,38.8 52,31.5 48.5,28 47.2,28 v47,27.8
  other vias: 46,41 48,41 48,43 46,43 45.2,53.6 45.2,51.2 45.2,48.8 48,48.8 50.8,48.8 50.8,51.2 50.8,53.6 53.6,48.8 45.2,46 48,46 50.8,43.2
  pour Top (isolate 0.6, rank 3, no thermals): 44.8,54 53.8,54 53.8,36.2 44.8,36.2
  pour Bottom (isolate 0.6, no thermals): 44.8,54 53.8,54 53.8,37.8 44.8,37.8
VOUT  (via drill 0.4, 0.6)
  Top 0.2: 30.95,26.25 C10.1
  Top 0.25: U$1.30 31.25,24.45 32.8,26 32.8,26.4 | 30.95,26.25 30.25,25.55 U$1.32 | U$1.34 29.25,25.35 28.8,25.8 27.8,25.8 27,26.6 27,27.35 28.65,29 C7.1 | U$1.35 28.75,24.65 28.1,25.3 27.1,25.3 26.2,26.2 26.2,27.2 | C10.1 28.95,29 C7.1 | C7.1 28.8,29.05 28.8,30.4
  Top 0.4: R10.2 24.8,31.2 23.8,30.2 23.8,29.6 26.2,27.2 | R11.1 34.25,31.35 35.2,30.4 35.2,28.8 32.8,26.4 | C14.1 9.4,24 9,24 | C13.1 6.4,24.6 7,24
  Top 0.8: C14.1 8.9,24.6 v8,25.5 7.1,24.6 C13.1 | U2.2 8.63,23.64 9,24 | U2.3 7.37,23.64 7,24
  Bottom 0.8: v8,25.5 9.5,27 22,27 25.5,30.5 v27.5,30.5
  other vias: 26,53.5 34,53.5 30,53.5 30,50.5 30,47.5 34,47.5 26,47.5 30,44 26,44 34,44 30,40.5 30,37 30,33.5 34,37 26,37 27.5,33.5 32.5,33.5 32.5,30.5 27.5,38 28,46 28,42 32.5,42 32.5,46 32.5,38
  pour Bottom (no thermals): 25.4,54 34.4,54 34.4,30 25.4,30
  pour Top (isolate 0.6, no thermals): 25.4,54 34.4,54 34.4,30 25.4,30

### Text on the board
tPlace: Primary Power | Output | Aux Power | VDRD | 2020
bPlace: Priority CH1 | Priority CH2 | CH2 DISABLE | SHUTDOWN | CH1 DISABLE | RETRY | CH2 AUTORELOAD | CH1 AUTORELOAD | Mfgr. sn.: | Board sn.: | GND | +5V | GND | +3v3 | GND | CH1_PGOOD | CH1_DISABLE | CH1_STATUS | CH1_FAULT | GND | RETRY | CH2_PGOOD | CH2_DISABLE | CH2_STATUS | CH2_FAULT | SHUTDOWN
bNames: - | + | + | - | - | + | + | - | - | + | + | - | Voltage Input CH1 | Max current CH1 | Voltage Input CH2 | Max current CH2